# Altium schematic sheet measurementarrayschematic.SchDoc
size 594 x 420 mm; SheetNumber: 1; SheetTotal: 1
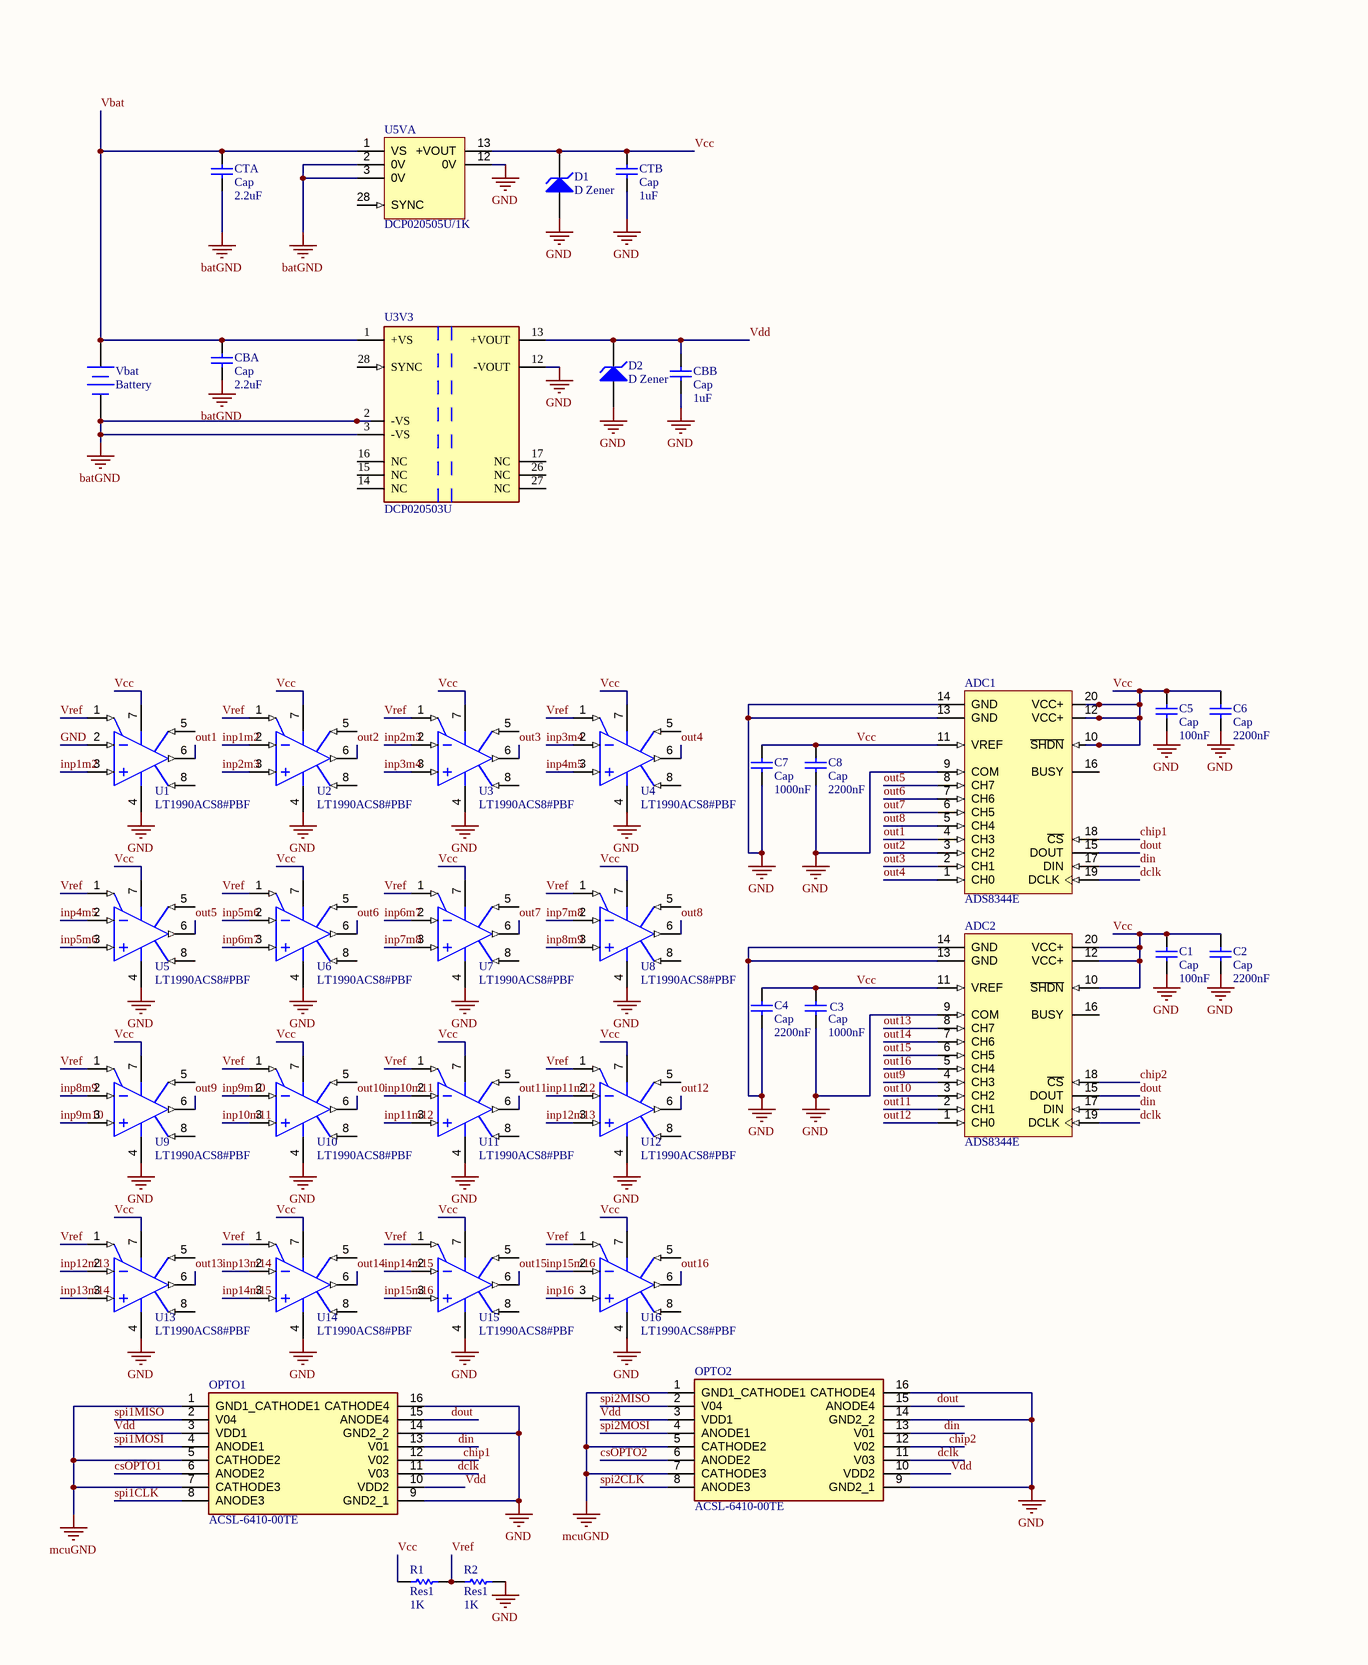
[diagram p0: measurementarrayschematic.SchDoc, left]
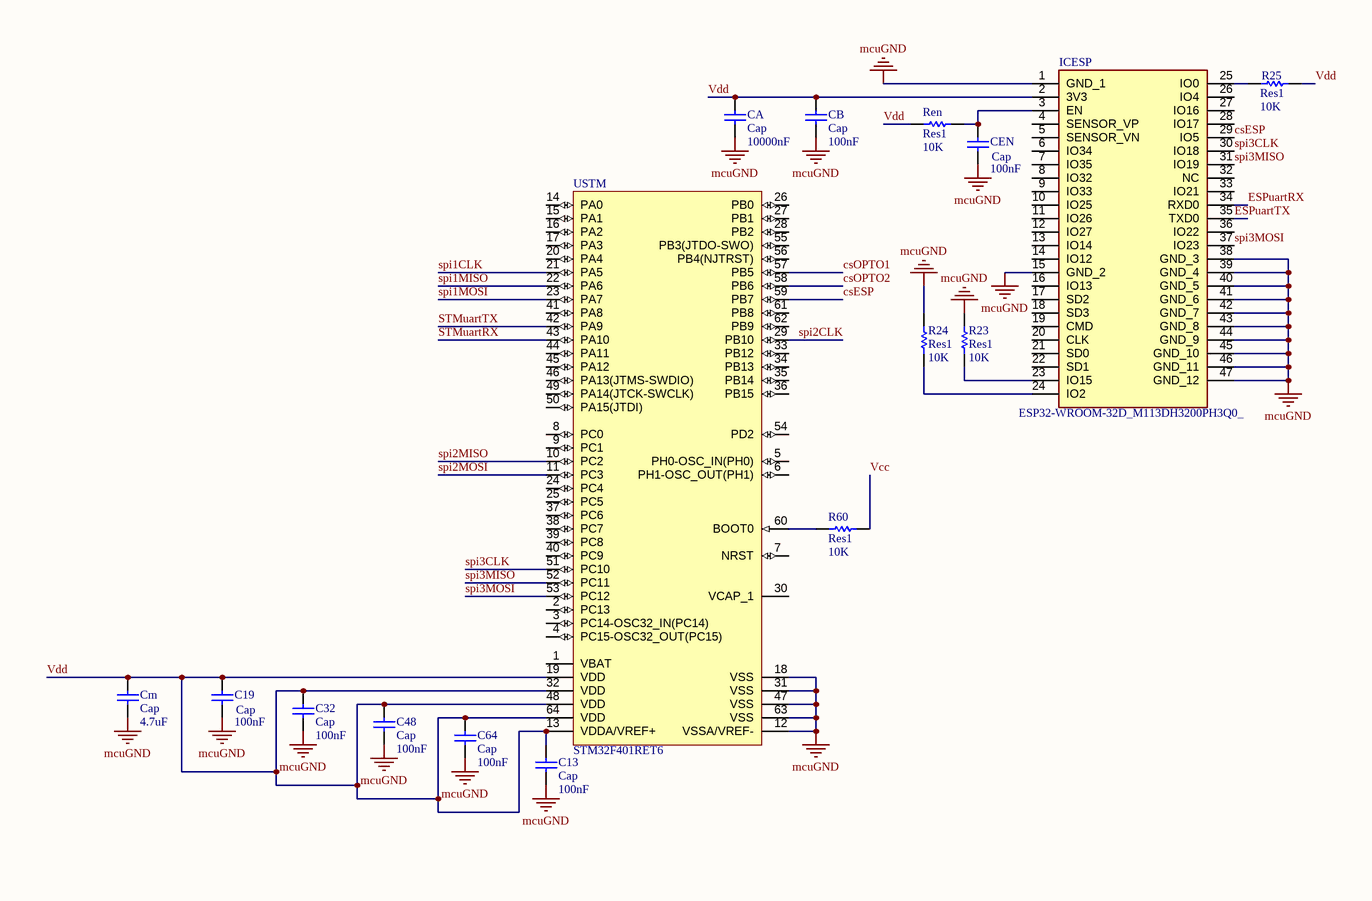
[diagram p1: measurementarrayschematic.SchDoc, right]

## Parts
ADC1  ADS8344E  [TI-DBQ20_L]
ADC2  ADS8344E  [TI-DBQ20_L]
C1  Cap  value 100nF  [RAD-0.3]
C2  Cap  value 2200nF  [RAD-0.3]
C3  Cap  value 1000nF  [RAD-0.3]
C4  Cap  value 2200nF  [RAD-0.3]
C5  Cap  value 100nF  [RAD-0.3]
C6  Cap  value 2200nF  [RAD-0.3]
C7  Cap  value 1000nF  [RAD-0.3]
C8  Cap  value 2200nF  [RAD-0.3]
C13  Cap  value 100nF  [RAD-0.3]
C19  Cap  value 100nF  [RAD-0.3]
C32  Cap  value 100nF  [RAD-0.3]
C48  Cap  value 100nF  [RAD-0.3]
C64  Cap  value 100nF  [RAD-0.3]
CA  Cap  value 10000nF  [RAD-0.3]
CB  Cap  value 100nF  [RAD-0.3]
CBA  Cap  value 2.2uF  [RAD-0.3]
CBB  Cap  value 1uF  [RAD-0.3]
CEN  Cap  value 100nF  [RAD-0.3]
Cm  Cap  value 4.7uF  [RAD-0.3]
CTA  Cap  value 2.2uF  [RAD-0.3]
CTB  Cap  value 1uF  [RAD-0.3]
D1  D Zener  [DIODE-0.7]
D2  D Zener  [DIODE-0.7]
ICESP  ESP32-WROOM-32D_M113DH3200PH3Q0_  [ESP32WROOM32DM113DH3200PH3Q0]
OPTO1  ACSL-6410-00TE  [SOIC127P599X152-16N]
OPTO2  ACSL-6410-00TE  [SOIC127P599X152-16N]
R1  Res1  value 1K  [AXIAL-0.3]
R2  Res1  value 1K  [AXIAL-0.3]
R23  Res1  value 10K  [AXIAL-0.3]
R24  Res1  value 10K  [AXIAL-0.3]
R25  Res1  value 10K  [AXIAL-0.3]
R60  Res1  value 10K  [AXIAL-0.3]
Ren  Res1  value 10K  [AXIAL-0.3]
U1  LT1990ACS8#PBF  [LT-S8-8_N]
U2  LT1990ACS8#PBF  [LT-S8-8_N]
U3  LT1990ACS8#PBF  [LT-S8-8_N]
U3V3  DCP020503U  [FP-DVB0012A-MFG]
U4  LT1990ACS8#PBF  [LT-S8-8_N]
U5  LT1990ACS8#PBF  [LT-S8-8_N]
U5V  DCP020505U/1K  [DVB0012A_L]  (part A of 2)
U6  LT1990ACS8#PBF  [LT-S8-8_N]
U7  LT1990ACS8#PBF  [LT-S8-8_N]
U8  LT1990ACS8#PBF  [LT-S8-8_N]
U9  LT1990ACS8#PBF  [LT-S8-8_N]
U10  LT1990ACS8#PBF  [LT-S8-8_N]
U11  LT1990ACS8#PBF  [LT-S8-8_N]
U12  LT1990ACS8#PBF  [LT-S8-8_N]
U13  LT1990ACS8#PBF  [LT-S8-8_N]
U14  LT1990ACS8#PBF  [LT-S8-8_N]
U15  LT1990ACS8#PBF  [LT-S8-8_N]
U16  LT1990ACS8#PBF  [LT-S8-8_N]
USTM  STM32F401RET6  [STM-LQFP64_L]
Vbat  Battery  [BAT-2]

## Nets
batGND: CBA.1 CTA.1 U3V3.2(-VS) U3V3.3(-VS) U5V.2(0V) U5V.3(0V) Vbat.2(-)
GND: ADC1.9(COM) ADC1.13(GND) ADC1.14(GND) ADC2.9(COM) ADC2.13(GND) ADC2.14(GND) C1.1 C2.1 C3.1 C4.1 C5.1 C6.1 C7.1 C8.1 CBB.1 CTB.1 D1.1(A) D2.1(A) OPTO1.9(GND2_1) OPTO1.14(GND2_2) OPTO1.16(CATHODE4) OPTO2.9(GND2_1) OPTO2.14(GND2_2) OPTO2.16(CATHODE4) R2.1 U1.2(-IN) U1.4(V-) U2.4(V-) U3.4(V-) U3V3.12(-VOUT) U4.4(V-) U5.4(V-) U5V.12(0V) U6.4(V-) U7.4(V-) U8.4(V-) U9.4(V-) U10.4(V-) U11.4(V-) U12.4(V-) U13.4(V-) U14.4(V-) U15.4(V-) U16.4(V-)
mcuGND: C13.1 C19.1 C32.1 C48.1 C64.1 CA.1 CB.1 CEN.1 Cm.1 ICESP.1(GND_1) ICESP.15(GND_2) ICESP.38(GND_3) ICESP.39(GND_4) ICESP.40(GND_5) ICESP.41(GND_6) ICESP.42(GND_7) ICESP.43(GND_8) ICESP.44(GND_9) ICESP.45(GND_10) ICESP.46(GND_11) ICESP.47(GND_12) OPTO1.1(GND1_CATHODE1) OPTO1.5(CATHODE2) OPTO1.7(CATHODE3) OPTO2.1(GND1_CATHODE1) OPTO2.5(CATHODE2) OPTO2.7(CATHODE3) R23.1 R24.1 USTM.12(VSSA/VREF-) USTM.18(VSS) USTM.31(VSS) USTM.47(VSS) USTM.63(VSS)
chip1: ADC1.18(~{CS}) OPTO1.12(V02)
chip2: ADC2.18(~{CS}) OPTO2.12(V02)
csESP: ICESP.29(IO5) USTM.59(PB7)
csOPTO1: OPTO1.6(ANODE2) USTM.57(PB5)
csOPTO2: OPTO2.6(ANODE2) USTM.58(PB6)
dclk: ADC1.19(DCLK) ADC2.19(DCLK) OPTO1.11(V03) OPTO2.11(V03)
din: ADC1.17(DIN) ADC2.17(DIN) OPTO1.13(V01) OPTO2.13(V01)
dout: ADC1.15(DOUT) ADC2.15(DOUT) OPTO1.15(ANODE4) OPTO2.15(ANODE4)
ESPuartRX: ICESP.34(RXD0)
ESPuartTX: ICESP.35(TXD0)
inp1m2: U1.3(+IN) U2.2(-IN)
inp2m3: U2.3(+IN) U3.2(-IN)
inp3m4: U3.3(+IN) U4.2(-IN)
inp4m5: U4.3(+IN) U5.2(-IN)
inp5m6: U5.3(+IN) U6.2(-IN)
inp6m7: U6.3(+IN) U7.2(-IN)
inp7m8: U7.3(+IN) U8.2(-IN)
inp8m9: U8.3(+IN) U9.2(-IN)
inp9m10: U9.3(+IN) U10.2(-IN)
inp10m11: U10.3(+IN) U11.2(-IN)
inp11m12: U11.3(+IN) U12.2(-IN)
inp12m13: U12.3(+IN) U13.2(-IN)
inp13m14: U13.3(+IN) U14.2(-IN)
inp14m15: U14.3(+IN) U15.2(-IN)
inp15m16: U15.3(+IN) U16.2(-IN)
inp16: U16.3(+IN)
out1: ADC1.4(CH3) U1.6(OUT)
out2: ADC1.3(CH2) U2.6(OUT)
out3: ADC1.2(CH1) U3.6(OUT)
out4: ADC1.1(CH0) U4.6(OUT)
out5: ADC1.8(CH7) U5.6(OUT)
out6: ADC1.7(CH6) U6.6(OUT)
out7: ADC1.6(CH5) U7.6(OUT)
out8: ADC1.5(CH4) U8.6(OUT)
out9: ADC2.4(CH3) U9.6(OUT)
out10: ADC2.3(CH2) U10.6(OUT)
out11: ADC2.2(CH1) U11.6(OUT)
out12: ADC2.1(CH0) U12.6(OUT)
out13: ADC2.8(CH7) U13.6(OUT)
out14: ADC2.7(CH6) U14.6(OUT)
out15: ADC2.6(CH5) U15.6(OUT)
out16: ADC2.5(CH4) U16.6(OUT)
spi1CLK: OPTO1.8(ANODE3) USTM.21(PA5)
spi1MISO: OPTO1.2(V04) USTM.22(PA6)
spi1MOSI: OPTO1.4(ANODE1) USTM.23(PA7)
spi2CLK: OPTO2.8(ANODE3) USTM.29(PB10)
spi2MISO: OPTO2.2(V04) USTM.10(PC2)
spi2MOSI: OPTO2.4(ANODE1) USTM.11(PC3)
spi3CLK: ICESP.30(IO18) USTM.51(PC10)
spi3MISO: ICESP.31(IO19) USTM.52(PC11)
spi3MOSI: ICESP.37(IO23) USTM.53(PC12)
STMuartRX: USTM.43(PA10)
STMuartTX: USTM.42(PA9)
Vbat: CBA.2 CTA.2 U3V3.1(+VS) U5V.1(VS) Vbat.1(+)
Vcc: ADC1.10(~{SHDN}) ADC1.11(VREF) ADC1.12(VCC+) ADC1.20(VCC+) ADC2.10(~{SHDN}) ADC2.11(VREF) ADC2.12(VCC+) ADC2.20(VCC+) C1.2 C2.2 C3.2 C4.2 C5.2 C6.2 C7.2 C8.2 CTB.2 D1.2(K) R1.2 R60.2 U1.7(V+) U2.7(V+) U3.7(V+) U4.7(V+) U5.7(V+) U5V.13(+VOUT) U6.7(V+) U7.7(V+) U8.7(V+) U9.7(V+) U10.7(V+) U11.7(V+) U12.7(V+) U13.7(V+) U14.7(V+) U15.7(V+) U16.7(V+)
Vdd: C13.2 C19.2 C32.2 C48.2 C64.2 CA.2 CB.2 CBB.2 Cm.2 D2.2(K) ICESP.2(3V3) OPTO1.3(VDD1) OPTO1.10(VDD2) OPTO2.3(VDD1) OPTO2.10(VDD2) R25.2 Ren.1 U3V3.13(+VOUT) USTM.13(VDDA/VREF+) USTM.19(VDD) USTM.32(VDD) USTM.48(VDD) USTM.64(VDD)
Vref: R1.1 R2.2 U1.1(REF) U2.1(REF) U3.1(REF) U4.1(REF) U5.1(REF) U6.1(REF) U7.1(REF) U8.1(REF) U9.1(REF) U10.1(REF) U11.1(REF) U12.1(REF) U13.1(REF) U14.1(REF) U15.1(REF) U16.1(REF)
NetCEN_2: CEN.2 ICESP.3(EN) Ren.2
NetICESP_23: ICESP.23(IO15) R23.2
NetICESP_24: ICESP.24(IO2) R24.2
NetICESP_25: ICESP.25(IO0) R25.1
NetR60_1: R60.1 USTM.60(BOOT0)

Not connected (* = marked no-connect by the designer): ADC1 16(BUSY); ADC2 16(BUSY); ICESP 4(SENSOR_VP) 5(SENSOR_VN) 6(IO34) 7(IO35) 8(IO32) 9(IO33) 10(IO25) 11(IO26) 12(IO27) 13(IO14) 14(IO12) 16(IO13) 17(SD2) 18(SD3) 19(CMD) 20(CLK) 21(SD0) 22(SD1) 26(IO4) 27(IO16) 28(IO17) 32(NC) 33(IO21) 36(IO22); U1 5(GAIN2) 8(GAIN1); U2 5(GAIN2) 8(GAIN1); U3 5(GAIN2) 8(GAIN1); U3V3 14(NC) 15(NC) 16(NC) 17(NC) 26(NC) 27(NC) 28(SYNC); U4 5(GAIN2) 8(GAIN1); U5 5(GAIN2) 8(GAIN1); U5V 28(SYNC); U6 5(GAIN2) 8(GAIN1); U7 5(GAIN2) 8(GAIN1); U8 5(GAIN2) 8(GAIN1); U9 5(GAIN2) 8(GAIN1); U10 5(GAIN2) 8(GAIN1); U11 5(GAIN2) 8(GAIN1); U12 5(GAIN2) 8(GAIN1); U13 5(GAIN2) 8(GAIN1); U14 5(GAIN2) 8(GAIN1); U15 5(GAIN2) 8(GAIN1); U16 5(GAIN2) 8(GAIN1); USTM 1(VBAT) 2(PC13) 3(PC14-OSC32_IN(PC14)) 4(PC15-OSC32_OUT(PC15)) 5(PH0-OSC_IN(PH0)) 6(PH1-OSC_OUT(PH1)) 7(NRST) 8(PC0) 9(PC1) 14(PA0) 15(PA1) 16(PA2) 17(PA3) 20(PA4) 24(PC4) 25(PC5) 26(PB0) 27(PB1) 28(PB2) 30(VCAP_1) 33(PB12) 34(PB13) 35(PB14) 36(PB15) 37(PC6) 38(PC7) 39(PC8) 40(PC9) 41(PA8) 44(PA11) 45(PA12) 46(PA13(JTMS-SWDIO)) 49(PA14(JTCK-SWCLK)) 50(PA15(JTDI)) 54(PD2) 55(PB3(JTDO-SWO)) 56(PB4(NJTRST)) 61(PB8) 62(PB9)

## Notes on the sheet
- DWG NO:
- REV:
- THIS DOCUMENT AND THE DATA DISCLOSED HEREIN OR
- HEREWITH IS THE PROPERTY OF ALTIUM LIMITED AND MAY
- BE FREELY DISTRIBUTED IN WHOLE. NO RIGHTS ARE
- RESERVED OR EXPRESS OR IMPLIED WARANTEE GIVEN.
- REVISION
- DESCRIPTION
- DATE
- APPROVED
- ENG:
- APPROVALS
- PROJECT
- DSN:
- CHK:
- REFERENCE DOCUMENTS
- PROJECT REVISION:
- TITLE
- DOCUMENT REVISION:
- DESIGN ITEM:
- BOM:
- FAB DWG:
- PCB DWG:
- ASSY DWG:
- SCALE:
- A2
- SIZE
- CAGE CODE
- FILE NAME
- DWG NO.
- SHEET
- OF
- REV

## Library data of the parts
ADC1 ADC2 = CMP-0003-01312-1: 16-Bit, 8-Channel Serial Output Sampling ADC, -40 to 85 degC, 20-pin SOP (DBQ20), Green (RoHS & no Sb/Br); Manufacturer: Texas Instruments; Architecture: SAR; Digital Supply(Max)(V): 5.25; SINAD(dB): 86; Sample Rate (max)(SPS): 100k; SFDR(dB): 92; Interface: Serial SPI; Digital Supply(Min)(V): 2.7; SubFamily: Precision ADC (<=10MSPS); Resolution(Bits): 16; INL(Max)(+/-LSB): 6; # Input Channels: 8; Mounting Technology: Surface Mount; Code_JEDEC: MO-137; PackageDescription: 20-Pin Plastic Small Outline, Body 8.65 x 3.9 mm, Pitch 0.635 mm; ComponentLink2Description: Datasheet; ComponentLink3Description: Package Specification; PackageReference: DBQ20; DatasheetVersion: SBAS139E; ComponentLink1Description: Manufacturer URL; ComponentLink1URL: http://www.ti.com/; PackageVersion: 4073301-3/H, 10/2008; ComponentLink3URL: http://www.ti.com/litv/pdf/mpds210a; Analog Voltage AV/DD(Min)(V): 2.7; PartNumber: ADS8344E; Analog Voltage AV/DD(Max)(V): 5.25; Eco-Plan: Green (RoHS & no Sb/Br); ComponentLink2URL: http://www.ti.com/general/docs/lit/getliterature.tsp?genericPartNumber=ADS8344&fileType=pdf
C1-C8 C13 C19 C32 C48 C64 CA CB CBA CBB CEN Cm CTA CTB = Cap: Capacitor; Published: 8-Jun-2000; LatestRevisionDate: 17-Jul-2002; LatestRevisionNote: Re-released for DXP Platform.; PackageReference: RAD-0.3; Publisher: Altium Limited; PackageDescription: Radial Cap, Thru-Hole; 2 Leads; 0.3 in Pin Spacing
D1 D2 = D Zener: Zener Diode; Published: 8-Jun-2000; LatestRevisionDate: 17-Jul-2002; LatestRevisionNote: Re-released for DXP Platform.; PackageReference: DIODE-0.7; Publisher: Altium Limited; PackageDescription: Diode, Thru-Hole; 2 Leads; 0.7 in Pin Spacing
ICESP = ESP32-WROOM-32D_M113DH3200PH3Q0_: Integrated Circuit; Manufacturer_Name: Espressif Systems; Manufacturer_Part_Number: ESP32-WROOM-32D(M113DH3200PH3Q0); Datasheet Link: https://www.mouser.in/datasheet/2/891/esp32-wroom-32d_esp32-wroom-32u_datasheet_en-1365844.pdf; Height: 3.2mm
OPTO1 OPTO2 = ACSL-6410-00TE: Integrated Circuit; Manufacturer_Name: Avago Technologies; Datasheet Link: https://docs.broadcom.com/docs/AV02-0235EN; Height: 1.524mm; Manufacturer_Part_Number: ACSL-6410-00TE; Mouser Part Number: 630-ACSL-6410-00TE; Mouser Price/Stock: https://www.mouser.co.uk/ProductDetail/Broadcom-Avago/ACSL-6410-00TE?qs=RuhU64sK2%252Btb4Jggwyh%252BkA%3D%3D
R1 R2 R23-R25 R60 Ren = Res1: Resistor; Published: 8-Jun-2000; LatestRevisionDate: 17-Jul-2002; LatestRevisionNote: Re-released for DXP Platform.; PackageReference: AXIAL-0.3; Publisher: Altium Limited; PackageDescription: Axial Device, Thru-Hole; 2 Leads; 0.3 in Pin Spacing
U1-U16 = CMP-0359-03362-2: Single Channel, Integrated Resistors, Micropower, Difference Amplifier, 0.1 MHz Typical GBW, 0.55 V/us Typical SR, 2.4 to 36 V, 8-Pin SOIC (S8-8), Commercial, Pb-Free; Manufacturer: Linear Technology; Linear Technology Part Number: LT1990; Vos (mV) Guaranteed: 5.2; GBW (MHz) Typical: 0.1; Is (mA) Typical: 0.14; SR (V/us) Typical: 0.55; Channels (#): 1; Vos (mV) Typical: 0.9; Vs Max (V): 36; Vs Min (V): 2.4; ComponentLink1Description: Manufacturer URL; DatasheetVersion: Rev. B; PartNumber: LT1990ACS8#PBF; RoHS: Pb-Free; PackageVersion: Rev G; PackageReference: LT-S8-8; ComponentLink2URL: http://cds.linear.com/docs/en/datasheet/1990fb.pdf; ComponentLink2Description: Datasheet; PackageDescription: 8-Pin Plastic Small Outline, Body 4.9 x 3.9 mm, Pitch 1.27 mm; ComponentLink3Description: Package Specification; ComponentLink1URL: http://www.linear.com/; Type: SGA; ComponentLink3URL: http://cds.linear.com/docs/en/packaging/05081610_G_SO8.pdf; Mounting Technology: Surface Mount; RevisionNote: URLs updated
U3V3 = CMP-0387-00169-3: DC DC CONVERTER 3.3V 2W; Frequency: 800kHz; Output Current: 606mA; Number of Outputs: 1; Max Input Voltage: 5.5V; Min Supply Voltage: 4.5V; Switching Frequency: 400kHz; Efficiency: 74%; Output Type: Fixed; Isolation Voltage: 1kV; Max Output Voltage: 3.46V; Max Power Dissipation: 59mW; Quiescent Current: 18mA; Min Output Voltage: 3.13V; Max Output Power: 2W; Nominal Output Voltage: 3.3V; Output Voltage: 3.3V; Number of Pins: 12; Features: OTP; Min Operating Temperature: -40°C; Package Quantity: 28; Lead Free: Lead Free; Max Operating Temperature: 85°C; Max Output Current: 606mA; Current - Output 1: 606mA; Min Input Voltage: 4.5V; Output Power: 2W; RoHS Compliant: Yes; Packaging: Rail/Tube; Voltage - Output 1: 3.3V; Radiation Hardening: No; Height: 0.1inch; Width: 0.3inch; Length: 0.71inch; Case/Package: SOP; Termination: SMD/SMT; REACH SVHC: No SVHC; Max Supply Voltage: 5.5V
U5V = CMP-0387-00170-2: Miniature, 2 W Isolated Unregulated DC-DC Converter, -40 to 85 degC, 12-pin SOP (DVB12), Pb-Free (RoHS); Manufacturer: Texas Instruments; SubFamily: 1 W & 2 W Miniature; Vin(Max)(V): 5.5; Iout(Max)(A): 0.4; Regulated Outputs(#): 1; Vout(Max)(V): 5.25; Vout(Min)(V): 4.75; Vin(Min)(V): 4.5; ComponentLink2URL: http://www.ti.com/general/docs/lit/getliterature.tsp?genericPartNumber=DCP020505&fileType=pdf; PackageReference: DVB0012A; Eco-Plan: Pb-Free (RoHS); ComponentLink4Description: URL Link1; ComponentLink2Description: Datasheet; ComponentLink1URL: http://www.ti.com/; ComponentLink3Description: Package Specification; Code_JEDEC: MS-013-AE; ComponentLink4URL: Samples URL:http://www.ti.com/product/dcp020505#samples; ComponentLink1Description: Manufacturer URL; DatasheetVersion: SBVS011K; PackageDescription: 12-Pin Plastic Small Outline, Body 17.9 x 7.5 mm; PartNumber: DCP020505U/1K; Mounting Technology: Surface Mount; PackageVersion: 4202104/B; ComponentLink3URL: http://www.ti.com/lit/ml/mpds106a/mpds106a.pdf
USTM = CMP-0243-00148-1: ARM Cortex-M4 32-bit MCU+FPU, 512 KB Flash, 96 KB Internal RAM, 50 I/Os, 64-Pin LQFP, -40 to 85 degC, Tray; Supply Voltage(Vcc) min (V): 1.7; Internal RAM Size (kB): 96; I/Os (High Current): 50; Operating Frequency(F) (Processor speed) (MHz): 84; FLASH Size (Prog) (kB): 512; Package Reference: 64-Pin Low-profile Quad Flat Package, Body 10 x 10 mm, Pitch 0.5 mm; Packing: Tray; DatasheetVersion: Rev. 3; Mounting Technology: Surface Mount; ComponentLink1Description: Manufacturer URL; Package Description: LQFP64; Core: ARM Cortex-M4; ComponentLink1URL: http://www.st.com/; ComponentLink2URL: http://www.st.com/st-web-ui/static/active/en/resource/technical/document/datasheet/DM00102166.pdf; ComponentLink2Description: Datasheet
Vbat = Battery: Multicell Battery; Published: 24-Mar-1999; LatestRevisionDate: 17-Jul-2002; LatestRevisionNote: Re-released for DXP Platform.; PackageReference: BAT-2; Publisher: Altium Limited; PackageDescription: Battery; 2 Leads